# Altium schematic sheet Sheet.SchDoc
size A4; SheetNumber: 1; SheetTotal: 1
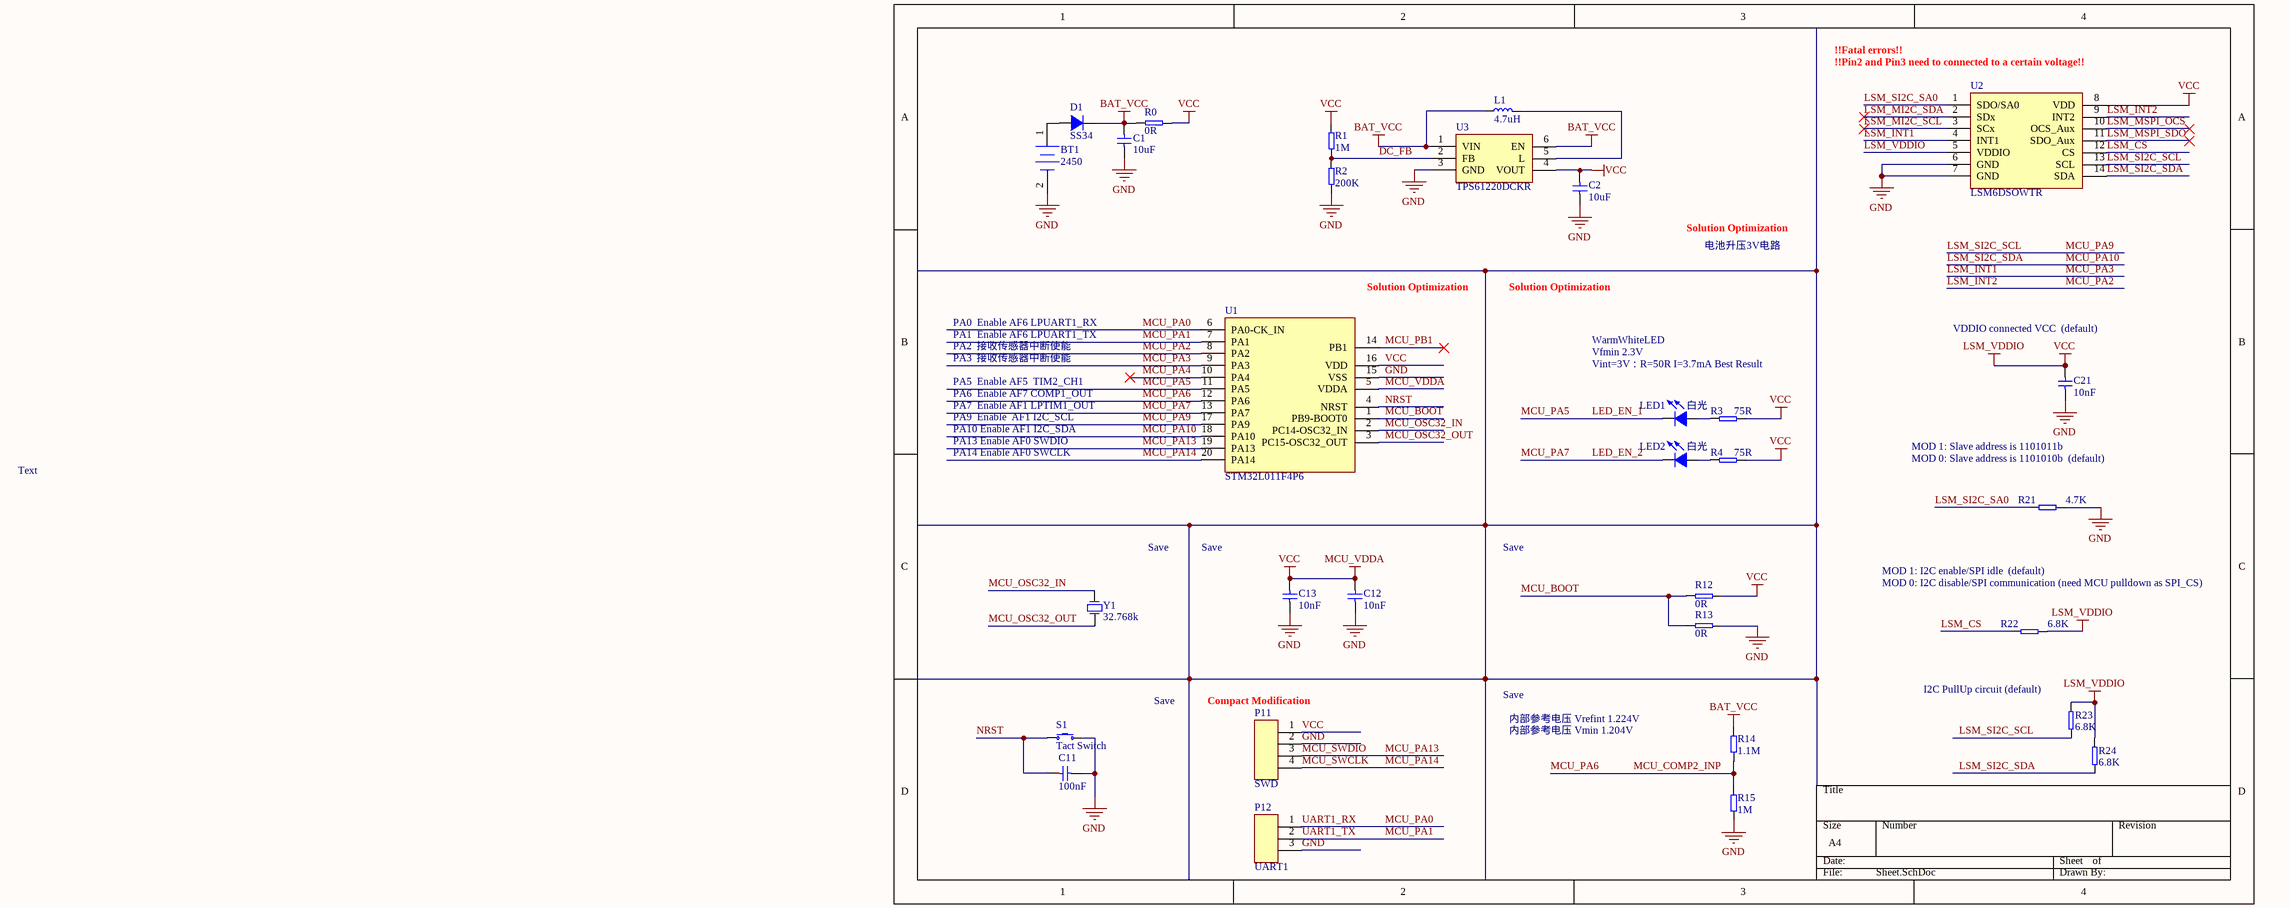
[diagram p0: Sheet.SchDoc]

## Parts
BT1  2450  [CR2450_CJ]
C1  10uF  [0603-C]
C2  10uF  [0603-C]
C11  100nF  [0603-C]
C12  10nF  [0603-C]
C13  10nF  [0603-C]
C21  10nF  [0603-C]
D1  SS34  [SOD-123]
L1  4.7uH  [0805-L]
LED1  白光  [0805-LED]
LED2  白光  [0805-LED]
P11  SWD  [2.54mm 1x4P]
P12  UART1  [2.54mm 1x3P]
R0  0R  [0603-R]
R1  1M  [0603-R]
R2  200K  [0603-R]
R3  75R  [0603-R]
R4  75R  [0603-R]
R12  0R  [0603-R]
R13  0R  [0603-R]
R14  1.1M  [0603-R]
R15  1M  [0603-R]
R21  4.7K  [0603-R]
R22  6.8K  [0603-R]
R23  6.8K  [0603-R]
R24  6.8K  [0603-R]
S1  Tact Switch  [TS-3025]
U1  STM32L011F4P6  [TSSOP-20]
U2  LSM6DSOWTR  [LGA-14L(2.5x3.0)]
U3  TPS61220DCKR  [SC-70-6]
Y1  32.768k  [SMD3215-2P]

## Nets
BAT_VCC: C1.2 D1.1 L1.1 R0.2 R14.2 U3.1(VIN) U3.6(EN)
GND: BT1.2(-) C1.1 C2.1 C11.2 C12.1 C13.1 C21.1 P11.2 P12.3 R2.1 R13.1 R15.1 R21.2 S1.2 U1.15(VSS) U2.6(GND) U2.7(GND) U3.3(GND)
LSM_VDDIO: C2.2 C12.2 C13.2 C21.2 P11.1 R0.1 R1.2 R3.2 R4.2 R12.1 R22.2 R23.2 R24.2 U1.5(VDDA) U1.16(VDD) U2.5(VDDIO) U2.8(VDD) U3.4(VOUT)  [also labelled MCU_VDDA, VCC]
DC_FB: R1.1 R2.2 U3.2(FB)
LED_EN_1: LED1.1 U1.11(PA5)  [also labelled MCU_PA5]
LED_EN_2: LED2.1 U1.13(PA7)  [also labelled MCU_PA7]
LSM_CS: R22.1 U2.12(CS)
LSM_INT1: U1.9(PA3) U2.4(INT1)  [also labelled MCU_PA3]
LSM_INT2: U1.8(PA2) U2.9(INT2)  [also labelled MCU_PA2]
LSM_MI2C_SCL: U2.3(SCx)
LSM_MI2C_SDA: U2.2(SDx)
LSM_MSPI_OCS: U2.10(OCS_Aux)
LSM_MSPI_SDO: U2.11(SDO_Aux)
LSM_SI2C_SA0: R21.1 U2.1(SDO/SA0)
LSM_SI2C_SCL: R23.1 U1.17(PA9) U2.13(SCL)  [also labelled MCU_PA9]
LSM_SI2C_SDA: R24.1 U1.18(PA10) U2.14(SDA)  [also labelled MCU_PA10]
MCU_BOOT: R12.2 R13.2 U1.1(PB9-BOOT0)
MCU_COMP2_INP: R14.1 R15.2 U1.12(PA6)  [also labelled MCU_PA6]
MCU_OSC32_IN: U1.2(PC14-OSC32_IN) Y1.2
MCU_OSC32_OUT: U1.3(PC15-OSC32_OUT) Y1.1
MCU_PA0: P12.1 U1.6(PA0-CK_IN)  [also labelled UART1_RX]
MCU_PA1: P12.2 U1.7(PA1)  [also labelled UART1_TX]
MCU_PA4: U1.10(PA4)
MCU_PA13: P11.3 U1.19(PA13)  [also labelled MCU_SWDIO]
MCU_PA14: P11.4 U1.20(PA14)  [also labelled MCU_SWCLK]
MCU_PB1: U1.14(PB1)
NRST: C11.1 S1.1 U1.4(NRST)
NetBT1_1: BT1.1(+) D1.2
NetL1_2: L1.2 U3.5(L)
NetLED1_2: LED1.2 R3.1
NetLED2_2: LED2.2 R4.1

## Notes on the sheet
- !!Fatal errors!!
- (near U2) !!Pin2 and Pin3 need to connected to a certain voltage!!
- Solution Optimization
- 电池升压3V电路
- PA0  Enable AF6 LPUART1_RX
- PA1  Enable AF6 LPUART1_TX
- (near U1) Solution Optimization
- (near C21) VDDIO connected VCC  (default)
- PA2  接收传感器中断使能
- PA3  接收传感器中断使能
- PA5  Enable AF5  TIM2_CH1
- WarmWhiteLED
- Vfmin 2.3V
- Vint=3V：R=50R I=3.7mA Best Result
- PA9  Enable  AF1 I2C_SCL
- PA10 Enable AF1 I2C_SDA
- PA13 Enable AF0 SWDIO
- PA14 Enable AF0 SWCLK
- PA6  Enable AF7 COMP1_OUT
- PA7  Enable AF1 LPTIM1_OUT
- MOD 1: Slave address is 1101011b
- Text
- MOD 0: Slave address is 1101010b  (default)
- Save
- MOD 1: I2C enable/SPI idle  (default)
- (near R22) MOD 0: I2C disable/SPI communication (need MCU pulldown as SPI_CS)
- (near R23) I2C PullUp circuit (default)
- (near P11) Compact Modification
- 内部参考电压 Vrefint 1.224V
- 内部参考电压 Vmin 1.204V

## Library data of the parts
BT1 = Battery: Multicell Battery; Published: 24-Mar-1999; LatestRevisionDate: 17-Jul-2002; LatestRevisionNote: Re-released for DXP Platform.; PackageReference: BAT-2; Publisher: Altium Limited; PackageDescription: Battery; 2 Leads
C1 C2 C11-C13 C21 = Cap
D1 = Diode
L1 = Inductor
LED1 LED2 = LED
P11 = Header 1x4P
P12 = Header 1x3P
R0-R4 R12-R15 R21-R24 = Res
U1 = STM32L011F4P6: Ultra-low-power 32-bit MCU Arm®-based / Cortex®-M0+, 16KB Flash, 2KB SRAM, 512B EEPROM, ADC/TSSOP-20
U2 = LSM6DSOWTR: 6-axis IMU (inertial measurement unit): / always-on 3‑axis accelerometer and 3‑axis gyroscop
U3 = TPS61220DCKR: TPS6122x Low Input Voltage, 0.7V Boost Converter With 5.5μA Quiescent Current
Y1 = XTAL